# EAGLE design kicker (EAGLE 9.6.2)
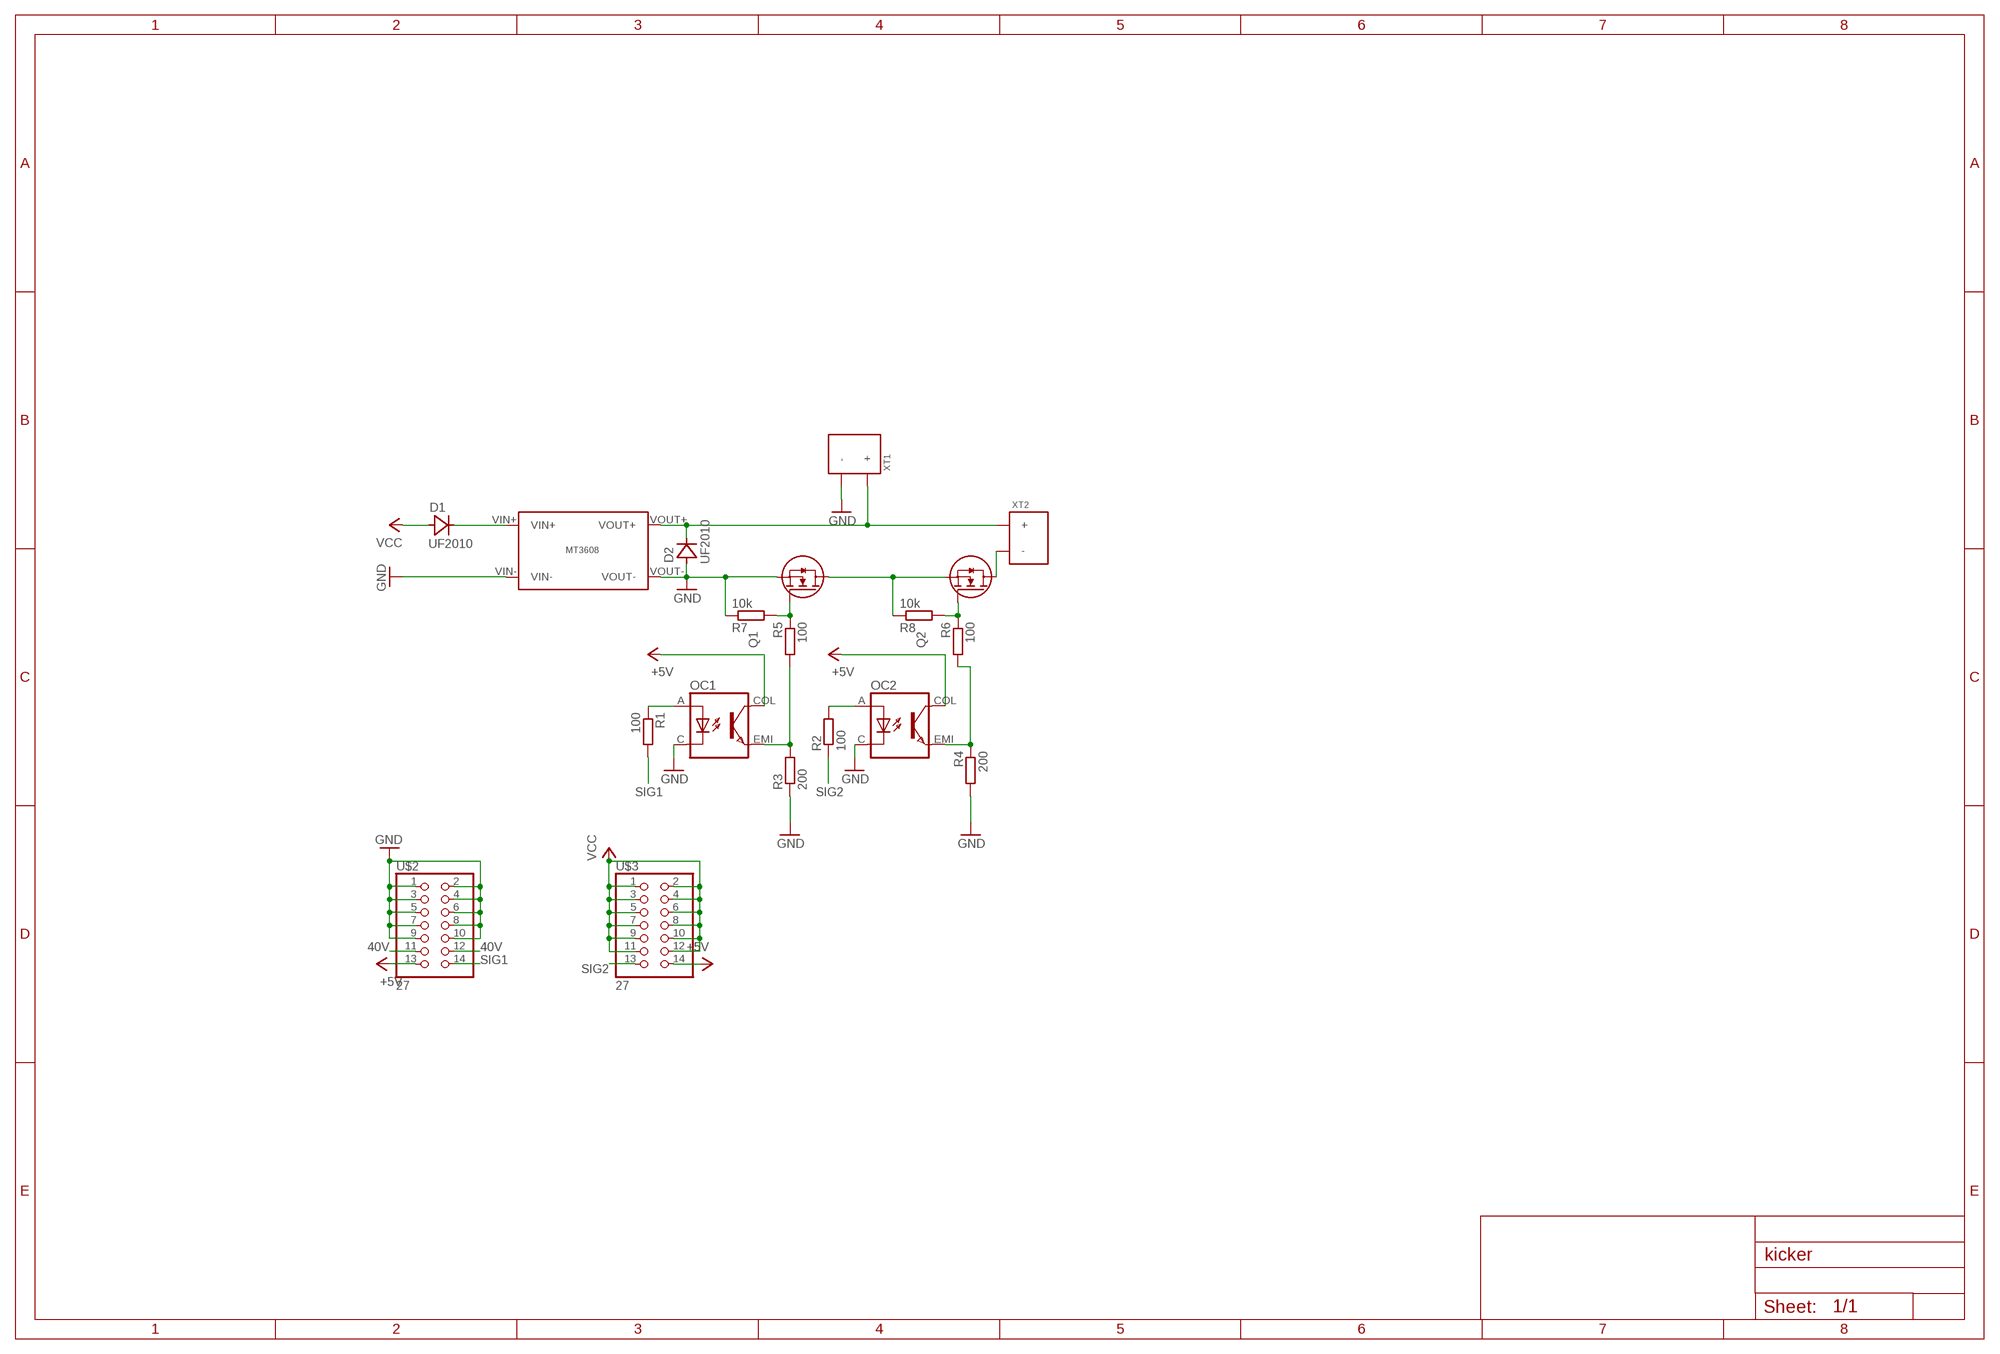
[diagram p0: schematic, sheet 1]

## Parts
D1  UF2010  [UF2010]
D2  UF2010  [UF2010]
OC1  TL293(GB)  [SOIC127P700X230-4N]
OC2  TL293(GB)  [SOIC127P700X230-4N]
Q1  NP52N06SLG  [TO230P1040X230-3N]
Q2  NP52N06SLG  [TO230P1040X230-3N]
R1  100  R-EU_R0603  [R0603]
R2  100  R-EU_R0603  [R0603]
R3  200  R-EU_R0603  [R0603]
R4  200  R-EU_R0603  [R0603]
R5  100  R-EU_R0603  [R0603]
R6  100  R-EU_R0603  [R0603]
R7  10k  R-EU_R0603  [R0603]
R8  10k  R-EU_R0603  [R0603]
U$1  MT3608  [MT3608]
U$2  27  [2*7]
U$3  27  [2*7]
XT1  XT30PW-F  [XT30PW-F]
XT2  XT30PW-F  [XT30PW-F]

## Nets
40V: D2.C U$1.VOUT+ U$2.11 U$2.12 XT1.+ XT2.+
+5V: OC1.COL OC2.COL U$2.13 U$3.14
GND: D2.A OC1.C OC2.C Q1.S R3.1 R4.2 R7.1 U$1.VIN- U$1.VOUT- U$2.1 U$2.2 U$2.3 U$2.4 U$2.5 U$2.6 U$2.7 U$2.8 U$2.9 U$2.10 XT1.-
N$1: D1.C U$1.VIN+
N$2: Q1.D Q2.S R8.1
N$3: OC1.EMI R3.2 R5.2
N$4: Q2.D XT2.-
N$5: OC1.A R1.1
N$6: OC2.A R2.2
N$7: OC2.EMI R4.1 R6.2
N$13: Q1.G R5.1 R7.2
N$14: Q2.G R6.1 R8.2
SIG1: R1.2 U$2.14
SIG2: R2.1 U$3.13
VCC: D1.A U$3.1 U$3.2 U$3.3 U$3.4 U$3.5 U$3.6 U$3.7 U$3.8 U$3.9 U$3.10 U$3.11 U$3.12

## Library data of the parts
D1 D2 = diode:UF2010
OC1 OC2 = TLP293(GB):TL293(GB)
Q1 Q2 = TO230P1040X230-3N:NP52N06SLG
R1-R8 = rcl:R-EU_: RESISTOR, European symbol; SPICEPREFIX: R
U$1 = MT3608:MT3608
U$2 U$3 = pin_socket:2*7
XT1 XT2 = XT:XT30PW-F

## Board
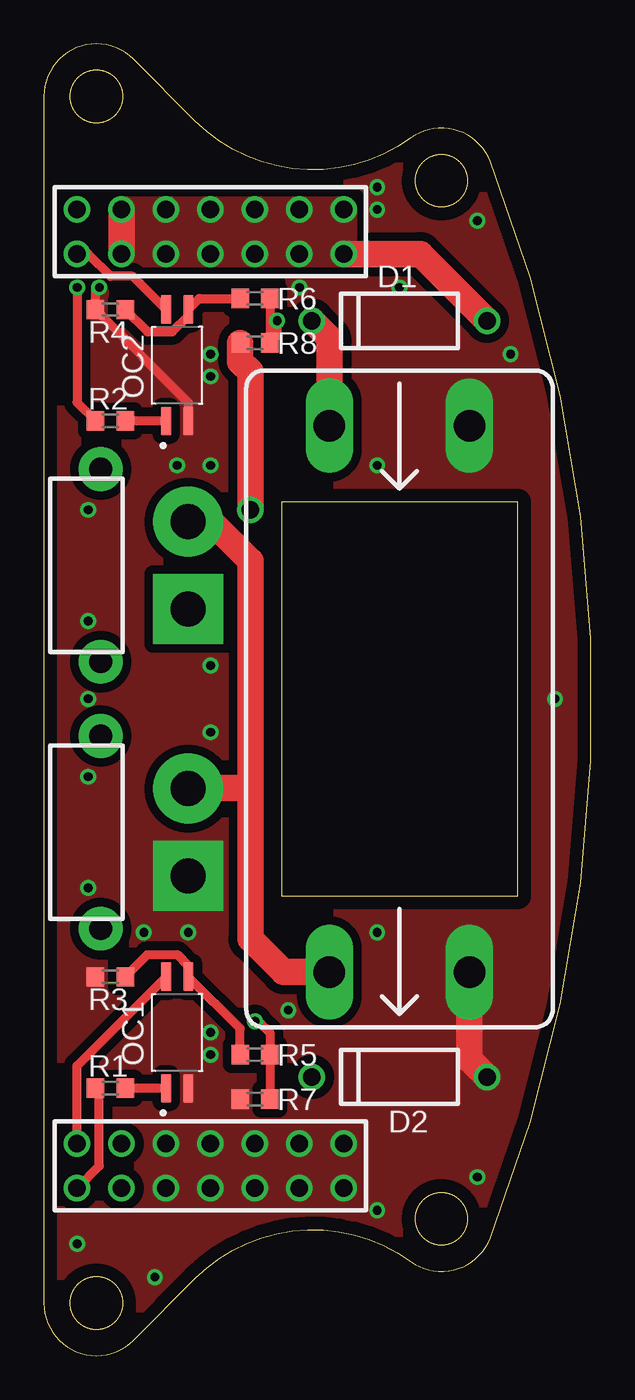
[diagram p1: board, top side]
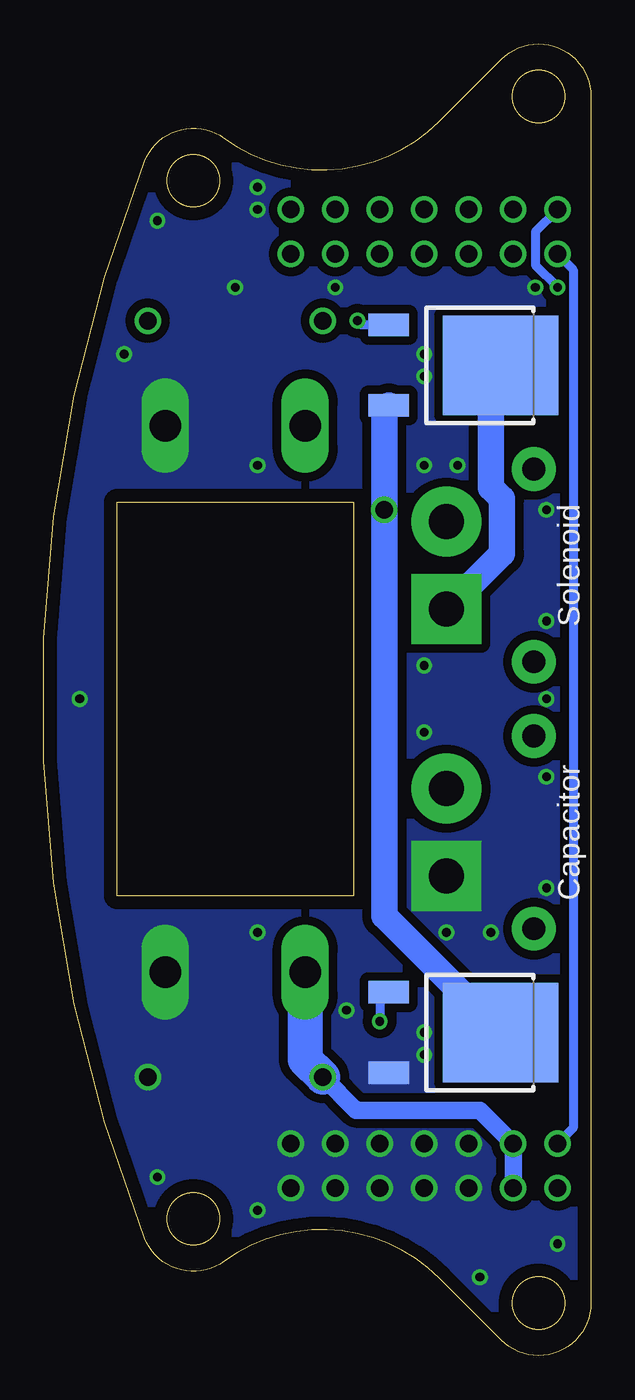
[diagram p2: board, bottom side, seen from below]

Size 31.26 x 74.91 mm. Coordinates in mm from the lower left corner, seen from the top.
Outline: 25.5,68.19 arc104 20.95,69.53
Outline: 20.95,69.53 arc-81 8.66,70.5
Outline: 5.12,74.03 arc135 0,71.91
Outline: 8.66,4.41 arc-81 20.95,5.39
Outline: 20.95,5.39 arc104 25.5,6.72
Outline: 8.66,4.41 5.12,0.88 arc-135 0,3 0,71.91
Outline: 8.66,4.41 arc-81 20.95,5.39
Outline: 20.95,5.39 arc104 25.5,6.72
Outline: 25.5,6.72 arc43 25.5,68.19
Outline: 25.5,68.19 arc104 20.95,69.53
Outline: 20.95,69.53 arc-81 8.66,70.5
Outline: 8.66,70.5 5.12,74.03
Outline: 5.12,74.03 arc135 0,71.91
Outline: circle at 22.71,7.82 radius 1.5
Outline: circle at 3,71.91 radius 1.5
Outline: circle at 22.71,67.1 radius 1.5
Outline: circle at 3,3 radius 1.5
Copper layers (1*16): Top 0.035mm / dielectric 1.5mm / Bottom 0.035mm
Design rules "default *": minimum track width 6mil, minimum drill 0.3mm, track to track 6mil, track to pad 6mil, pad to pad 6mil, via to via 6mil, smd to smd 6mil, copper to edge 30mil, drill to drill 6mil, minimum pad ring 10mil, minimum via ring 8mil, stop-mask expansion 4mil, vias tented up to drill 0mil, thermal gap 10mil

### Footprints (pad centres in the part's own frame; a part is rotated, then mirrored left to right if it is on the bottom)
UF2010 = drill 1: A 5,0; C -5,0
SOIC127P700X230-4N = smd 1.64 x 0.59: A -3.185,0.635; C -3.185,-0.635; COL 3.185,0.635; EMI 3.185,-0.635
TO230P1040X230-3N = smd 5.67 x 6.59: D 0,1.2 | smd 1.28 x 2.3: G -2.3,-5.2; S 2.3,-5.2
R0603 = smd 1 x 1.1: 1 -0.85,0; 2 0.85,0
MT3608 = drill 1.8 long: VIN+ 15.6,4; VIN- 15.6,-4; VOUT+ -15.6,4; VOUT- -15.6,-4
2*7 = drill 1: 1 -1.27,7.62; 2 1.27,7.62; 3 -1.27,5.08; 4 1.27,5.08; 5 -1.27,2.54; 6 1.27,2.54; 7 -1.27,0; 8 1.27,0; 9 -1.27,-2.54; 10 1.27,-2.54; 11 -1.27,-5.08; 12 1.27,-5.08; 13 -1.27,-7.62; 14 1.27,-7.62
XT30PW-F = drill 2 pad 4: + 0,-2.5 | drill 2 pad 4 square: - 0,2.5 | drill 1.3 pad 2.5: P$3 5,5.5; P$4 5,-5.5

### Placement (x,y rotation side)
D1  20.32,59.1 0 top
D2  20.32,15.92 0 top
OC1  7.62,18.46 90 top
OC2  7.62,56.56 90 top
Q1  6.35,18.46 270 bottom
Q2  6.35,56.56 270 bottom
R1  3.81,15.28 180 top
R2  3.81,53.38 0 top
R3  3.81,21.63 0 top
R4  3.81,59.73 180 top
R5  12.06,17.19 180 top
R6  12.06,60.37 180 top
R7  12.06,14.65 0 top
R8  12.06,57.83 0 top
U$1  20.32,37.51 90 top
U$2  9.53,10.84 270 top
U$3  9.53,64.18 270 top
XT1  8.26,29.89 180 top
XT2  8.26,45.13 180 top

### Tracks (layer width: path | path; a pad name or v marks a point on that pad's centre or on a via)
40V
  Top 1.5: XT2.+ 9.48,47.63 9.53,47.67 11.8,45.39 11.8,32.43 | U$1.VOUT+ 13.7,21.91 11.8,23.8 11.8,32.43 | XT1.+ 8.29,32.43 11.8,32.43
  Bottom 1: D2.C 13.41,14.01 6.35,14.01 U$2.11 U$2.12
  Bottom 2: U$1.VOUT+ 16.32,16.92 D2.C
+5V
  Top 0.5: U$2.13 1.91,16.56 OC1.COL | OC2.COL 5.09,61.64 3.81,61.64 2.54,62.91 U$3.14
  Bottom 0.5: U$3.14 1.01,62.02 1.01,13 U$2.13
GND  (via drill 0.5)
  Top 0.5: OC2.C 8.26,54.44 R4.2 2.96,60.79 v3.17,61
  Top 1.5: U$1.VOUT- 24.32,16.92 D2.A
  other vias: 1.91,6.39 6.35,4.49 19.05,8.3 24.77,10.2 19.05,50.84 26.67,57.19 20.32,61 19.05,24.17 29.21,37.51 9.53,18.46 9.53,17.19 14.61,61 9.53,55.92 9.53,57.19 19.05,66.72 24.77,64.81 9.53,50.84 7.62,50.84 13.97,19.73 19.05,65.45 5.71,24.17 8.26,24.17 2.54,26.71 2.54,33.06 9.53,39.41 9.53,35.6 2.54,37.51 2.54,48.3 2.54,41.95
  pour Top (isolate 0.5, rank 2, no thermals): -2.54,76.88 33.02,76.88 33.02,-3.13 -2.54,-3.13
  pour Bottom (isolate 0.5, no thermals): -5.08,75.61 31.75,75.61 31.75,-5.67 -5.08,-5.67
N$1
  Top 1.5: D1.C 16.32,58.1 U$1.VIN+
N$2  (via drill 1)
  Top 1.5: v11.8,48.3 11.8,56.18 11.21,56.77 R8.1
  Bottom 1.5: Q2.S 11.8,54 v11.8,48.3 11.8,25.11 Q1.D
N$3
  Top 0.5: R3.2 5.93,22.9 7.62,22.9 8.26,22.27 OC1.EMI 11.21,18.68 R5.2
N$4
  Bottom 1.5: XT2.- 5.08,45.8 5.08,48.94 5.71,49.57 5.71,55.99 Q2.D
N$5
  Top 0.5: R1.1 6.97,15.28 OC1.A
N$6
  Top 0.5: R2.2 6.97,53.38 OC2.A
N$7
  Top 0.5: R6.2 8.88,60.37 OC2.EMI 8.26,59.37 7.35,58.46 5.93,58.46 R4.1
N$13  (via drill 0.5)
  Top 0.5: v12.06,19.09 12.28,19.09 12.91,18.46 R5.1 R7.2
  Bottom 0.5: Q1.G 12.06,20.24 v12.06,19.09
N$14  (via drill 0.5)
  Top 0.5: R6.1 R8.2 13.34,58.25 v13.34,59.1
  Bottom 0.5: Q2.G 13.1,58.86 v13.34,59.1
SIG1
  Top 0.5: R1.2 3.17,15.07 3.17,10.84 U$2.14
SIG2  (via drill 0.5)
  Top 0.5: R2.1 1.91,54.44 v1.91,61
  Bottom 0.5: U$3.13 3.17,64.18 3.17,62.27 v1.91,61
VCC
  Top 1.5: U$3.2 21.51,62.91 D1.A | U$3.11 U$3.12
  pour Top (isolate 0.5, no thermals): 4.45,65.45 4.45,62.91 17.14,62.91 17.14,65.45

### Text on the board
bPlace: Solenoid | Capacitor